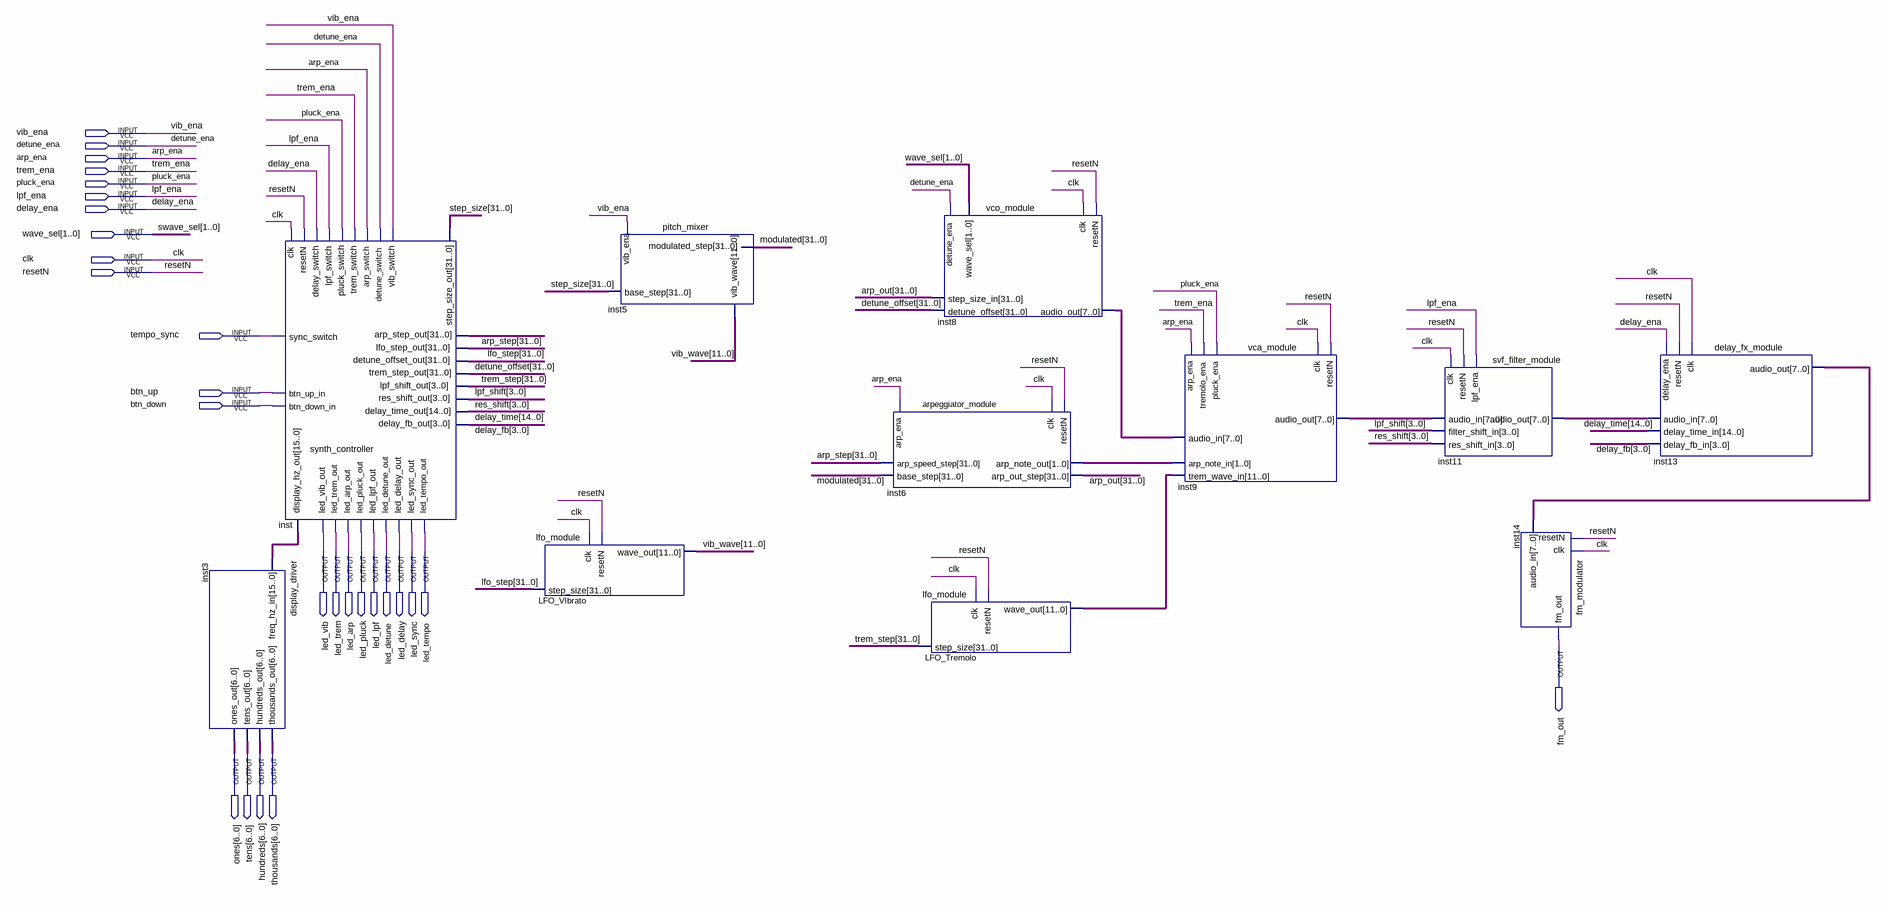
[diagram p0: schematic sheet]
// Quartus schematic ModularSynth_DSP.bdf as structural Verilog: 11 symbols, 27 pins
module ModularSynth_DSP (
  input  vib_ena,
  input  detune_ena,
  input  arp_ena,
  input  trem_ena,
  input  pluck_ena,
  input  lpf_ena,
  input  delay_ena,
  input  [1:0] wave_sel,
  input  clk,
  input  resetN,
  input  tempo_sync,
  input  btn_up,
  input  btn_down,
  output led_vib,
  output led_trem,
  output led_arp,
  output led_pluck,
  output led_lpf,
  output led_detune,
  output led_delay,
  output led_sync,
  output led_tempo,
  output fm_out,
  output [6:0] ones,
  output [6:0] tens,
  output [6:0] hundreds,
  output [6:0] thousands
);

  wire [1:0] inst6_arp_note_out;
  wire [3:0] delay_fb, lpf_shift, res_shift;
  wire [7:0] inst8_audio_out, inst9_audio_out, inst11_audio_out, inst13_audio_out;
  wire [11:0] LFO_Tremolo_wave_out, vib_wave;
  wire [14:0] delay_time;
  wire [15:0] inst_display_hz_out;
  wire [31:0] arp_out, arp_step, detune_offset, lfo_step, modulated, step_size, trem_step;

  display_driver inst3 (
    .freq_hz_in(inst_display_hz_out), .thousands_out(thousands), .hundreds_out(hundreds), .tens_out(tens),
    .ones_out(ones));
  synth_controller inst (
    .clk(clk), .resetN(resetN), .btn_up_in(btn_up), .btn_down_in(btn_down), .vib_switch(vib_ena),
    .trem_switch(trem_ena), .arp_switch(arp_ena), .lpf_switch(lpf_ena), .detune_switch(detune_ena),
    .delay_switch(delay_ena), .sync_switch(tempo_sync), .pluck_switch(pluck_ena), .step_size_out(step_size),
    .lfo_step_out(lfo_step), .trem_step_out(trem_step), .arp_step_out(arp_step), .lpf_shift_out(lpf_shift),
    .res_shift_out(res_shift), .detune_offset_out(detune_offset), .delay_time_out(delay_time),
    .delay_fb_out(delay_fb), .display_hz_out(inst_display_hz_out), .led_vib_out(led_vib),
    .led_trem_out(led_trem), .led_arp_out(led_arp), .led_pluck_out(led_pluck), .led_lpf_out(led_lpf),
    .led_detune_out(led_detune), .led_delay_out(led_delay), .led_sync_out(led_sync), .led_tempo_out(led_tempo));
  lfo_module LFO_VIbrato (.clk(clk), .resetN(resetN), .step_size(lfo_step), .wave_out(vib_wave));
  pitch_mixer inst5 (.base_step(step_size), .vib_ena(vib_ena), .vib_wave(vib_wave), .modulated_step(modulated));
  arpeggiator_module inst6 (
    .clk(clk), .resetN(resetN), .arp_ena(arp_ena), .arp_speed_step(arp_step), .base_step(modulated),
    .arp_out_step(arp_out), .arp_note_out(inst6_arp_note_out));
  vco_module inst8 (
    .clk(clk), .resetN(resetN), .step_size_in(arp_out), .wave_sel(wave_sel), .detune_ena(detune_ena),
    .detune_offset(detune_offset), .audio_out(inst8_audio_out));
  lfo_module LFO_Tremolo (.clk(clk), .resetN(resetN), .step_size(trem_step), .wave_out(LFO_Tremolo_wave_out));
  vca_module inst9 (
    .clk(clk), .resetN(resetN), .audio_in(inst8_audio_out), .tremolo_ena(trem_ena),
    .trem_wave_in(LFO_Tremolo_wave_out), .pluck_ena(pluck_ena), .arp_ena(arp_ena),
    .arp_note_in(inst6_arp_note_out), .audio_out(inst9_audio_out));
  svf_filter_module inst11 (
    .clk(clk), .resetN(resetN), .lpf_ena(lpf_ena), .audio_in(inst9_audio_out), .filter_shift_in(lpf_shift),
    .res_shift_in(res_shift), .audio_out(inst11_audio_out));
  fm_modulator inst14 (.clk(clk), .resetN(resetN), .audio_in(inst13_audio_out), .fm_out(fm_out));
  delay_fx_module inst13 (
    .clk(clk), .resetN(resetN), .delay_ena(delay_ena), .audio_in(inst11_audio_out),
    .delay_time_in(delay_time), .delay_fb_in(delay_fb), .audio_out(inst13_audio_out));

  // Other names for the same wires on the sheet: swave_sel[1:0] = wave_sel
endmodule
